# Altium schematic sheet GPSBoard_L30.SchDoc
size A4
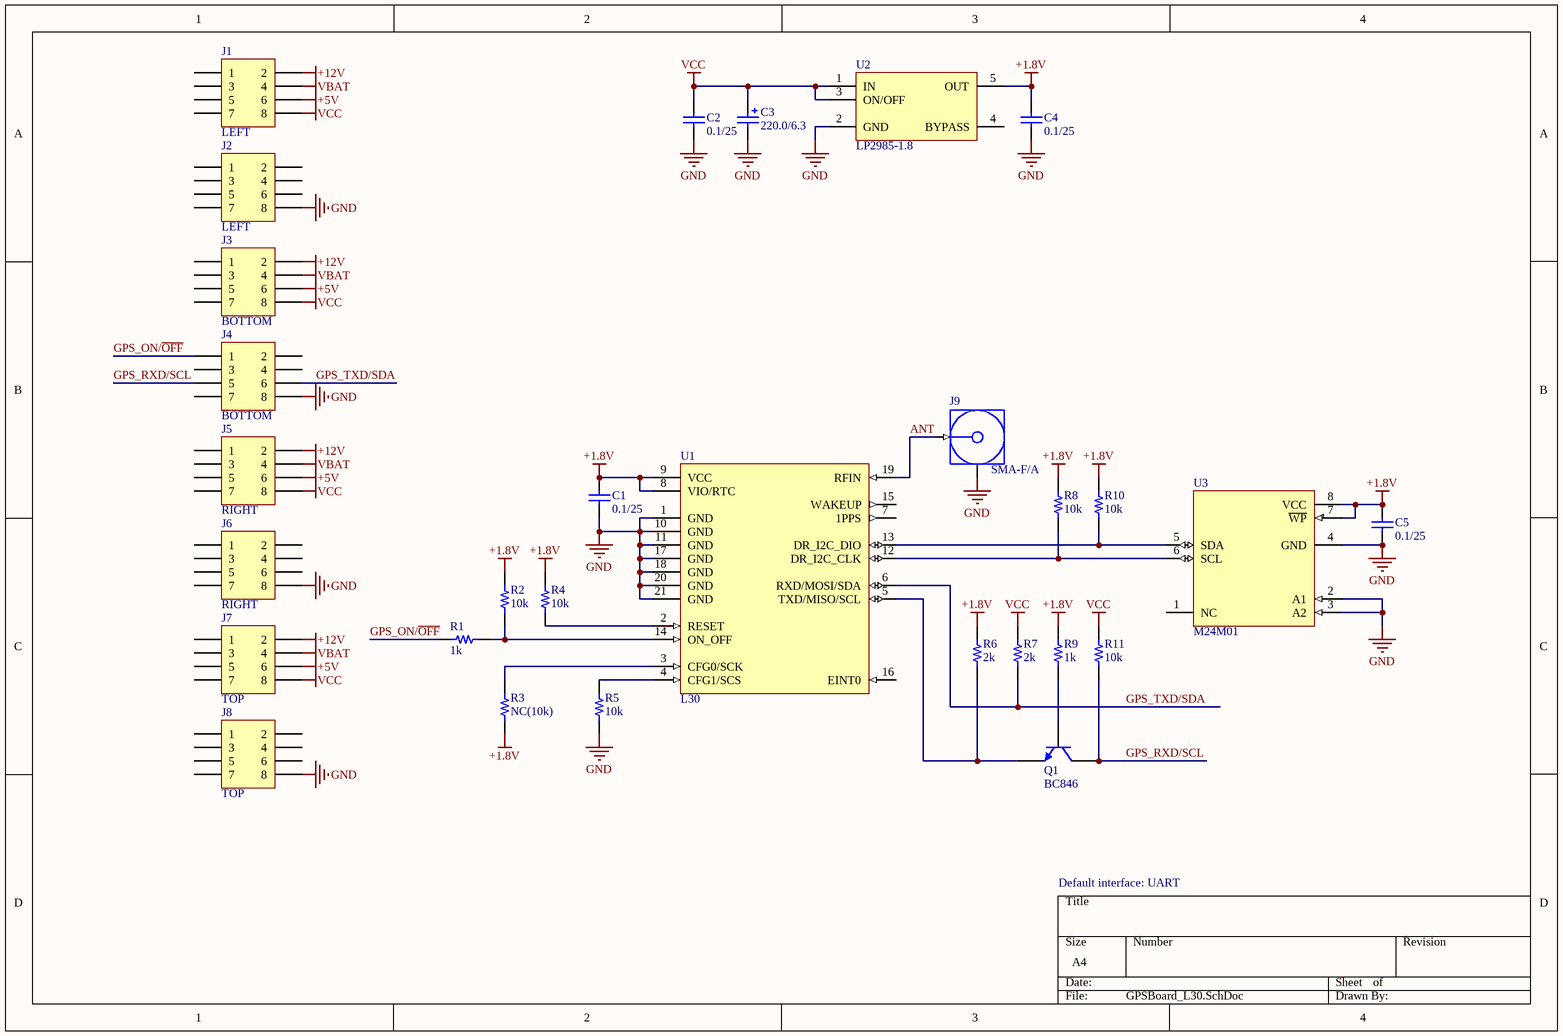
[diagram p0: GPSBoard_L30.SchDoc]

## Parts
C1  0.1/25  [CAP0402]
C2  0.1/25  [CAP0402]
C3  220.0/6.3  [SMC]
C4  0.1/25  [CAP0402]
C5  0.1/25  [CAP0402]
J1  LEFT  [PBDM-8]
J2  LEFT  [PBDM-8]
J3  BOTTOM  [PBDM-8]
J4  BOTTOM  [PBDM-8]
J5  RIGHT  [PBDM-8]
J6  RIGHT  [PBDM-8]
J7  TOP  [PBDM-8]
J8  TOP  [PBDM-8]
J9  SMA-F/A  [SMA-F/A]
Q1  BC846  [SOT23]
R1  1k  [RES0402]
R2  10k  [RES0402]
R3  NC(10k)  [RES0402]
R4  10k  [RES0402]
R5  10k  [RES0402]
R6  2k  [RES0402]
R7  2k  [RES0402]
R8  10k  [RES0402]
R9  1k  [RES0402]
R10  10k  [RES0402]
R11  10k  [RES0402]
U1  L30  [Quectel_L30]
U2  LP2985-1.8  [SOT23-5]
U3  M24M01  [SO8]

## Nets
+1.8V: C1.2 C4.2 C5.2 R2.1 R3.1 R4.1 R6.1 R8.2 R9.1 R10.2 U1.8(VIO/RTC) U1.9(VCC) U2.5(OUT) U3.7(~{WP}) U3.8(VCC)
+5V: J1.6 J3.6 J5.6 J7.6
+12V: J1.2 J3.2 J5.2 J7.2
GND: C1.1 C2.1 C3.1 C4.1 C5.1 J2.8 J4.8 J6.8 J8.8 J9.2(GND) R5.1 U1.1(GND) U1.10(GND) U1.11(GND) U1.17(GND) U1.18(GND) U1.20(GND) U1.21(GND) U2.2(GND) U3.2(A1) U3.3(A2) U3.4(GND)
VBAT: J1.4 J3.4 J5.4 J7.4
VCC: C2.2 C3.2 J1.8 J3.8 J5.8 J7.8 R7.1 R11.1 U2.1(IN) U2.3(ON/OFF)
ANT: J9.1(Signal) U1.19(RFIN)
GPS_ON/~{OFF}: J4.1 R1.1
GPS_RXD/SCL: J4.5 Q1.3(C) R11.2
GPS_TXD/SDA: J4.6 R7.2 U1.6(RXD/MOSI/SDA)
NetQ1_1: Q1.1(E) R6.2 U1.5(TXD/MISO/SCL)
NetQ1_2: Q1.2(B) R9.2
NetR1_2: R1.2 R2.2 U1.14(ON_OFF)
NetR3_2: R3.2 U1.3(CFG0/SCK)
NetR4_2: R4.2 U1.2(RESET)
NetR5_2: R5.2 U1.4(CFG1/SCS)
NetR8_1: R8.1 U1.12(DR_I2C_CLK) U3.6(SCL)
NetR10_1: R10.1 U1.13(DR_I2C_DIO) U3.5(SDA)

Not connected (* = marked no-connect by the designer): J1 1 3 5 7; J2 1 2 3 4 5 6 7; J3 1 3 5 7; J4 2 3 4 7; J5 1 3 5 7; J6 1 2 3 4 5 6 7; J7 1 3 5 7; J8 1 2 3 4 5 6 7; U1 7(1PPS) 15(WAKEUP) 16(EINT0); U2 4(BYPASS); U3 1(NC)

## Notes on the sheet
- Default interface: UART

## Library data of the parts
C1 C2 C4 C5 = CAP0402: Ceramic chip capacitor 0402; Value: 0.1; Voltage: 25; PartNumber: CAP0402; Category: Capacitor; Author: oiezhov
C3 = TAJC: Standard tantalum SMT capacitor, size C; PartNumber: TAJC; Value: 220.0; Voltage: 6.3; Category: Capacitor; ComponentLink1Description: Datasheet; ComponentLink1URL: d:\_AltiumLibs\Pdf\Passive\Capacitors\TAJ - AVX.pdf; Author: oiezhov
J1-J8 = PBDM-8: 2x4-pin header, pitch 2.54 mm; PartNumber: PBDM-8; Category: Connector; ComponentLink1Description: Datasheet; ComponentLink1URL: d:\_AltiumLibs\Pdf\Mechanical\Connector\pbsm.pdf; Author: oiezhov
J9 = SMA-F/A: Angle SMA female connector; PartNumber: SMA-F/A; Category: Connector; Author: oiezhov
Q1 = BC846: NPN Silicon AF Transistor; PackageReference: SOT-23; PartNumber: BC846; Category: Transistor; ComponentLink1Description: Datasheet; ComponentLink1URL: d:\_AltiumLibs\Pdf\Discrete\Transistor\BC846-BC850.pdf; Author: oiezhov
R1-R11 = RES0402: Ceramic chip resistor; PartNumber: RES0402; Category: Resistor; Author: oiezhov
  R1 R9: Value: 1k
  R2 R4 R5 R8 R10 R11: Value: 10k
  R3: Value: NC(10k)
  R6 R7: Value: 2k
U1 = L30: GPS Engine; PartNumber: L30; Category: IC/GPS; ComponentLink1Description: Datasheet; ComponentLink1URL: d:\_AltiumLibs\Pdf\IC\Gps\L30_HD_V1.0.pdf; Author: oiezhov
U2 = LP2985-1.8: 150-mA Low-Noise Low-Dropout Regulator with Shutdown; PartNumber: LP2985-1.8; Category: IC/Voltage Regulator; ComponentLink1Description: Datasheet; ComponentLink1URL: d:\_AltiumLibs\Pdf\IC\VoltageRegulator\LP2985 (TI).pdf; Author: oiezhov
U3 = M24M01: 1-Mbit serial I²C bus EEPROM; PartNumber: M24M01; Category: IC/Memory; ComponentLink1Description: Datasheet; ComponentLink1URL: d:\_AltiumLibs\Pdf\IC\Memory\M24M01-R M24M01-DF.pdf; Author: oiezhov